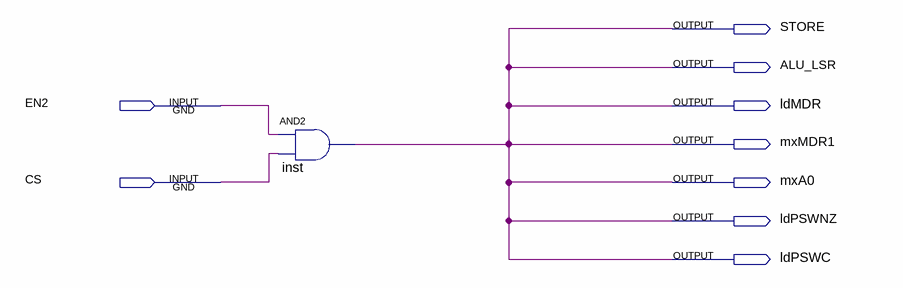
[diagram p0: schematic sheet]
// Quartus schematic LSR.bdf as structural Verilog: 1 symbols, 9 pins
module LSR (
  input  EN2,
  input  CS,
  output STORE,
  output ALU_LSR,
  output ldMDR,
  output mxMDR1,
  output mxA0,
  output ldPSWNZ,
  output ldPSWC
);

  and inst (ALU_LSR, EN2, CS);

  assign ldMDR = ALU_LSR;
  assign ldPSWC = ALU_LSR;
  assign ldPSWNZ = ALU_LSR;
  assign mxA0 = ALU_LSR;
  assign mxMDR1 = ALU_LSR;
  assign STORE = ALU_LSR;
endmodule
